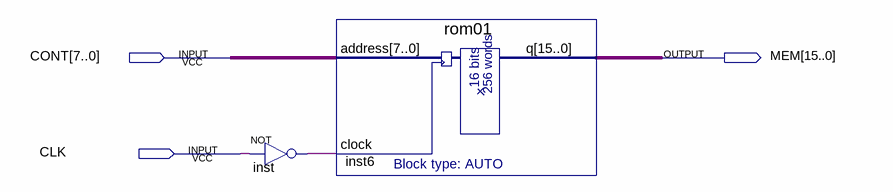
[diagram p0: schematic sheet]
// Quartus schematic Memoria.bdf as structural Verilog: 2 symbols, 3 pins
module Memoria (
  input  [7:0] CONT,
  input  CLK,
  output [15:0] MEM
);

  wire inst_out;

  not inst (inst_out, CLK);
  rom01 inst6 (.address(CONT), .clock(inst_out), .q(MEM));
endmodule
